# EAGLE schematic SN74AHC1G09 (EAGLE 9.1.3)
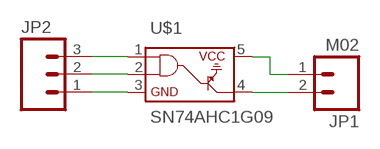
[diagram p0: schematic, sheet 1]

## Parts
JP1  M02  [1X02]
JP2  M03  [1X03]
U$1  SN74AHC1G09  [SOT-23-5]

## Nets
N$1: JP2.3 U$1.1
N$2: JP2.2 U$1.2
N$3: JP2.1 U$1.3
N$4: JP1.2 U$1.4
N$5: JP1.1 U$1.5

## Library data of the parts
JP1 = HyTechDevices:M02: Standard 2-pin 0.1" header. NOTES ON THE VARIANTS LOCK and LOCK_LONGPADS... This footprint was designed to help hold the alignment of a through-hole component (i.e. 6-pin header) while soldering it into place. You may notice that each hole has been shifted either up or down by 0.005 of an inch from it's more standard position (which is a perfectly straight line). This slight alteration caused the pins (the squares in the middle) to touch the edges of the holes. Because they are alternating, it causes a "brace" to hold the component in place. 0.005 has proven to be the perfect amount of "off-center" position when using our standard breakaway headers. Although looks a little odd when you look at the bare footprint, once you have a header in there, the alteration is very hard to notice. Also,if you push a header all the way into place, it is covered up entirely on the bottom side. This idea of altering the position of holes to aid alignment will be further integrated into the Sparkfun Library for other footprints. It can help hold any component with 3 or more connection pins. Note: The Sparkfun version includes many other packages including surface mount that may be of future interest. Source: Sparkfun <https://github.com/sparkfun/SparkFun-Eagle-Libraries>
JP2 = HyTechDevices:M03: Standard 3-pin 0.1" header.
U$1 = HyTechDevices:SN74AHC1G09: TI SN74AHC1G09 Single 2–Input Positive-AND Gate With Open-Drain Output Datasheet <http://www.ti.com/lit/ds/symlink/sn74ahc1g09.pdf>